# Altium project Luke_Optical_Fibre_IGBT_Driver.PrjPCB
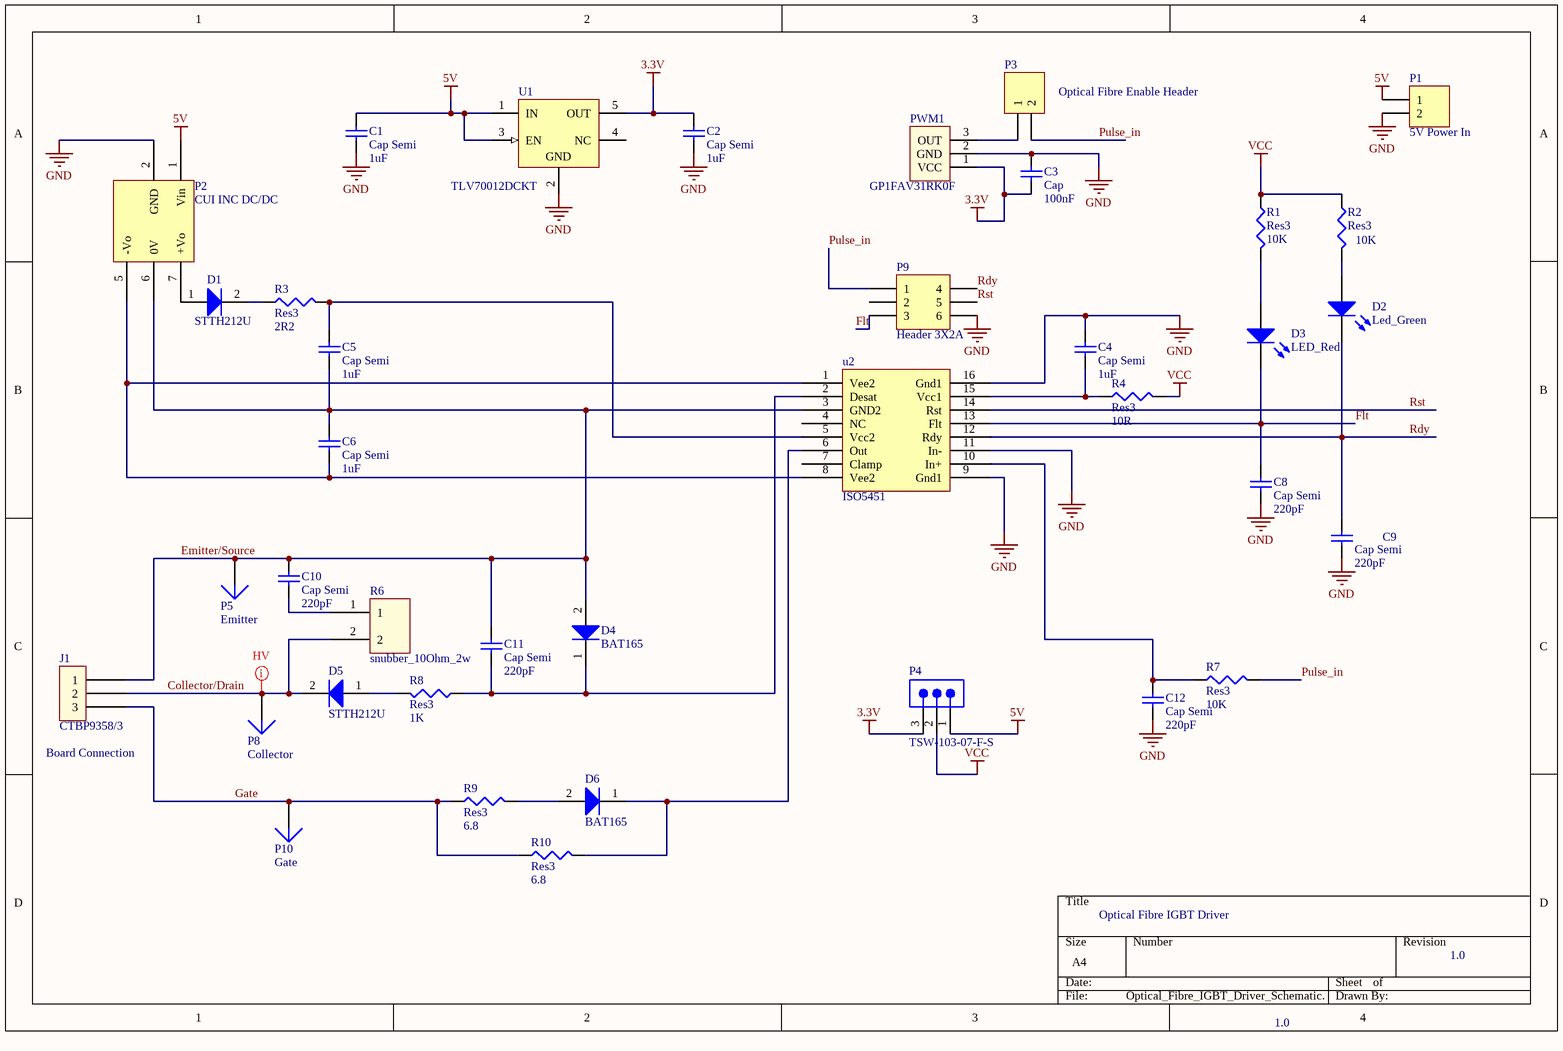
[diagram p0: Optical_Fibre_IGBT_Driver_Schematic.SchDoc]
1 sheet, 38 parts. Net scope: global (net labels, ports and power ports of the same name join across sheets).
Board file: Luke_Optical_Fibre_IGBT_Driver_PCB.PcbDoc

## Sheet Optical_Fibre_IGBT_Driver_Schematic.SchDoc
size A4

### Parts
C1  Cap Semi  value 1uF  [6-0805_M]
C2  Cap Semi  value 1uF  [6-0805_M]
C3  Cap  value 100nF  [6-0805_M]
C4  Cap Semi  value 1uF  [6-0805_M]
C5  Cap Semi  value 1uF  [6-0805_M]
C6  Cap Semi  value 1uF  [6-0805_M]
C8  Cap Semi  value 220pF  [6-0805_M]
C9  Cap Semi  value 220pF  [6-0805_M]
C10  Cap Semi  value 220pF  [C1206]
C11  Cap Semi  value 220pF  [6-0805_M]
C12  Cap Semi  value 220pF  [6-0805_M]
D1  STTH212U  [GESC-GAP3SLT33-214-2_V]
D2  Led_Green  [3.2X1.6X1.1]
D3  LED_Red  [3.2X1.6X1.1]
D4  BAT165  [ONSC-SOD-323-2-477-02_V]
D5  STTH212U  [GESC-GAP3SLT33-214-2_V]
D6  BAT165  [ONSC-SOD-323-2-477-02_V]
J1  CTBP9358/3  [CTBP9358/3]
P1  5V Power In  [HDR1X2]
P2  CUI INC DC/DC  [DIP10]
P3  Optical Fibre Enable Header  [HDR1X2]
P4  TSW-103-07-F-S  [SMTC-TSW-103-07-X-S]
P5  Emitter  [PIN1]
P8  Collector  [PIN1]
P9  Header 3X2A  [HDR2X3_CEN]
P10  Gate  [PIN1]
PWM1  GP1FAV31RK0F  [GP1FAV31*K0F]
R1  Res3  value 10K  [6-0805_M]
R2  Res3  value 10K  [6-0805_M]
R3  Res3  value 2R2  [6-0805_M]
R4  Res3  value 10R  [6-0805_M]
R6  snubber_10Ohm_2w  [SMDres]
R7  Res3  value 10K  [6-0805_M]
R8  Res3  value 1K  [6-0805_M]
R9  Res3  value 6.8  [6-0805_M]
R10  Res3  value 6.8  [6-0805_M]
U1  TLV70012DCKT  [DCK0005A_L]
u2  ISO5451  [SOIC127P1030X265-16M]

### Nets
3.3V: C2.2 C3.1 P4.3 PWM1.1(VCC) U1.5(OUT)
5V: C1.2 P1.1 P2.1(Vin) P4.1 U1.1(IN) U1.3(EN)
GND: C1.1 C2.1 C3.2 C4.1 C8.1 C9.1 C12.1 P1.2 P2.2(GND) P9.6 PWM1.2(GND) U1.2(GND) u2.9(Gnd1) u2.11(In-) u2.16(Gnd1)
VCC: P4.2 R1.1 R2.1 R4.2
Collector/Drain: D5.2 J1.2 P8.1 R6.2
Emitter/Source: C5.2 C6.2 C10.1 C11.1 D4.2(A) J1.1 P2.6(0V) P5.1 u2.3(GND2)
Flt: C8.2 D3.2(K) P9.3 u2.13(Flt)
Gate: J1.3 P10.1 R9.1 R10.1
Pulse_in: P3.2 P9.1 R7.2
Rdy: C9.2 D2.2(K) P9.4 u2.12(Rdy)
Rst: P9.5 u2.14(Rst)
NetC4_2: C4.2 R4.1 u2.15(Vcc1)
NetC5_1: C5.1 R3.2 u2.5(Vcc2)
NetC6_1: C6.1 P2.5(-Vo) u2.1(Vee2) u2.8(Vee2)
NetC10_2: C10.2 R6.1
NetC11_2: C11.2 D4.1(K) R8.1 u2.2(Desat)
NetC12_2: C12.2 R7.1 u2.10(In+)
NetD1_1: D1.1(A) P2.7(+Vo)
NetD1_2: D1.2 R3.1
NetD2_1: D2.1(A) R2.2
NetD3_1: D3.1(A) R1.2
NetD5_1: D5.1(A) R8.2
NetD6_1: D6.1(K) R10.2 u2.6(Out)
NetD6_2: D6.2(A) R9.2
NetP3_1: P3.1 PWM1.3(OUT)

Not connected (* = marked no-connect by the designer): P9 2; U1 4(NC); u2 4(NC) 7(Clamp)

### Layout directives
net class HV; rule Clearance Constraint [Generic clearance = 120mil, and 18 value(s) for objects]: Collector/Drain

### Notes on the sheet
- (near J1) Board Connection
- Optical Fibre IGBT Driver
- 1.0

### Library data of the parts
C1 C2 C4-C6 C8-C12 = Cap Semi: Capacitor (Semiconductor SIM Model); Published: 8-Jun-2000; LatestRevisionDate: 29-May-2009; LatestRevisionNote: IPC-7351 Footprint Added.; PackageReference: C1206; Publisher: Altium Limited; PackageDescription: Chip Capacitor
C3 = Cap: Capacitor; Published: 8-Jun-2000; LatestRevisionDate: 17-Jul-2002; LatestRevisionNote: Re-released for DXP Platform.; PackageReference: RAD-0.3; Publisher: Altium Limited; PackageDescription: Radial Cap, Thru-Hole; 2 Leads; 0.3 in Pin Spacing
D1 D5 = CMP-2000-05135-1: Silicon Carbide Power Schottky Diode, 3300 V, - 0.3 A, -55 to 175 degC, 2-Pin SMD, RoHS, Tape and Reel; Vf - Forward Voltage: 4V; Vrrm - Repetitive Reverse Voltage: 3300V; Brand: GeneSiCSemiconductor; Ifsm - Forward Surge Current: 10A; If - Forward Current: 0.3A; Pd - Power Dissipation: 25W; Package Version: Rev. 1, 11/2013; Unit Weight: 0.003284oz; Ir - Reverse Current: 100uA; trr - Reverse Recovery time: 60ns; Configuration: Single; Maximum Operating Temperature: +175C; Factory Pack Quantity: 2500; Package Description: 2-Pin Chip, Body 4.57 x 3.94 mm; Product Category: SchottkyDiodes&Rectifiers; Minimum Operating Temperature: -55C; Manufacturer: GeneSiCSemiconductor; Technology: SiC; Datasheet Version: Rev. 1, 11/2013; Package / Case: DO-214AA; Product: SchottkySiliconCarbideDiodes; Datasheet URL: https://datasheet.ciiva.com/24141/gap3slt33-214-271329-24141300.pdf; Operating Temperature Range: -55Cto+175C; RoHS: True; Mounting Style: SMD/SMT; Packaging: Reel; Series: GAP3SLT33; Package URL: https://datasheet.ciiva.com/24141/gap3slt33-214-271329-24141300.pdf; Manufacturer URL: http://www.genesicsemi.com/
D2 D3 = LED2: Typical RED, GREEN, YELLOW, AMBER GaAs LED; Published: 8-Jun-2000; LatestRevisionDate: 17-Jul-2002; LatestRevisionNote: Re-released for DXP Platform.; PackageVersion: Feb-2002; PackageReference: 3.2X1.6X1.1; Publisher: Altium Limited; PackageDescription: SM LED; 2 Flat Leads
D4 D6 = CMP-1055-00472-1: Schottky Barrier Diode, 2-Pin SOD-323, Pb-Free, Tape and Reel; PartNumber: NSR0340HT1G; Manufacturer: On Semiconductor; IFSM Max (A): 1; Configuration: Single; PackageDescription: 2-Pin SOD, Body 1.7 x 1.25 mm; ComponentLink2Description: Datasheet; ComponentLink3URL: http://www.onsemi.com/pub_link/Collateral/477-02.PDF.1; Packing: Tape and Reel; PackageVersion: Rev. H, 03/2007; ComponentLink1URL: http://www.onsemi.com/; ComponentLink2URL: http://www.onsemi.cn/pub_link/Collateral/NSR0340H-D.PDF; ComponentLink3Description: Package Specification; ComponentLink1Description: Manufacturer URL; Mounting Technology: Surface Mount; RoHS: TRUE; PackageReference: SOD-323-2-477-02; DatasheetVersion: Rev. 1
J1 = CTBP9358/3: CTBP9358/3 -  Terminal Block, Closed Ended, Header, 5.08 mm, 3 Ways, Through Hole Right Angle
P1 P3 = Header 2: Header, 2-Pin; LatestRevisionDate: 17-Jul-2002; LatestRevisionNote: Re-released for DXP Platform.; Publisher: Altium Limited
P2 = Component_1: Isolated DC DC Converter; LatestRevisionDate: 17-Jul-2002; LatestRevisionNote: Re-released for DXP Platform.; Publisher: Altium Limited
P4 = CMP-1024-00331-1: 0.025" SQ Post Header, Through-hole, Vertical, -55 to 125 degC, 2.54 mm Pitch, 3-Pin, Male, RoHS; Manufacturer: Samtec; Pitch: 2.54 mm; DatasheetVersion: F-214; ComponentLink1Description: Manufacturer URL; ComponentLink3URL: http://www.samtec.com/documents/webfiles/cpdf/TSW-XXX-XX-XXX-X-XX-XXX-MKT.pdf; Mounting Technology: Through-hole; PackageDescription: .025[0.64] SQ. Post Terminal Strip Assembly; Temperature Range: -55 to 125 degC; ComponentLink3Description: Package Specification; Orientation: Vertical; PartNumber: TSW-103-07-F-S; RoHS: True; PackageVersion: DM, 8/1988; ComponentLink2Description: Datasheet; ComponentLink1URL: http://www.samtec.com; ComponentLink2URL: http://www.samtec.com/documents/webfiles/pdf/TSW_TH.PDF; PackageReference: TSW-103-07-X-S
P5 P8 P10 = Plug: LatestRevisionDate: 17-Jul-2002; LatestRevisionNote: Re-released for DXP Platform.; Publisher: Altium Limited
P9 = Header 3X2A: Header, 3-Pin, Dual row; LatestRevisionDate: 17-Jul-2002; LatestRevisionNote: Re-released for DXP Platform.; Publisher: Altium Limited
PWM1 = GP1FAV31RK0F: Fiber Optic Receiver, 15.5 Mbps
R1-R4 R7-R10 = Res3: Resistor; Published: 8-Jun-2000; LatestRevisionDate: 29-May-2009; LatestRevisionNote: IPC-7351 Footprint Added.; PackageReference: J1-0603; Publisher: Altium Limited; PackageDescription: Chip Resistor
R6 = Shunt resistor: SMD Shunt resistor
U1 = CMP-0394-00926-2: Single Output LDO, 200 mA, Fixed 1.2 V Output, 2 to 5.5 V Input, with Low IQ, 5-pin SC70 (DCK), -40 to 125 degC, Green (RoHS & no Sb/Br); Manufacturer: Texas Instruments; SubFamily: Single Channel LDO; Fixed Output Options(V): 1.2; Iout(Max)(A): 0.2; Vin(Min)(V): 2; Iq(Typ)(mA): 0.03; Vin(Max)(V): 5.5; Vdo(Typ)(mV): 175; Code_JEDEC: MO-203; PackageDescription: 5-Pin Plastic Small-Outline, Body 2 x 1.25 mm, Pitch 0.65 mm; ComponentLink2URL: http://www.ti.com/general/docs/lit/getliterature.tsp?genericPartNumber=TLV70012&fileType=pdf; Accuracy(%): 2; ComponentLink1URL: http://www.ti.com/; Mounting Technology: Surface Mount; Vout Adj(Max)(V): 1.2; ComponentLink2Description: Datasheet; ComponentLink3URL: http://www.ti.com/litv/pdf/mpds025f; DatasheetVersion: SLVSA00D; PackageReference: DCK0005A; ComponentLink1Description: Manufacturer URL; Eco-Plan: Green (RoHS & no Sb/Br); ComponentLink3Description: Package Specification; PackageVersion: 4093553-3/G; PartNumber: TLV70012DCKT; Vout Adj(Min)(V): 1.2
u2 = Component_1